# Altium schematic sheet 15_Power_DCIN.SchDoc
size 420 x 297 mm
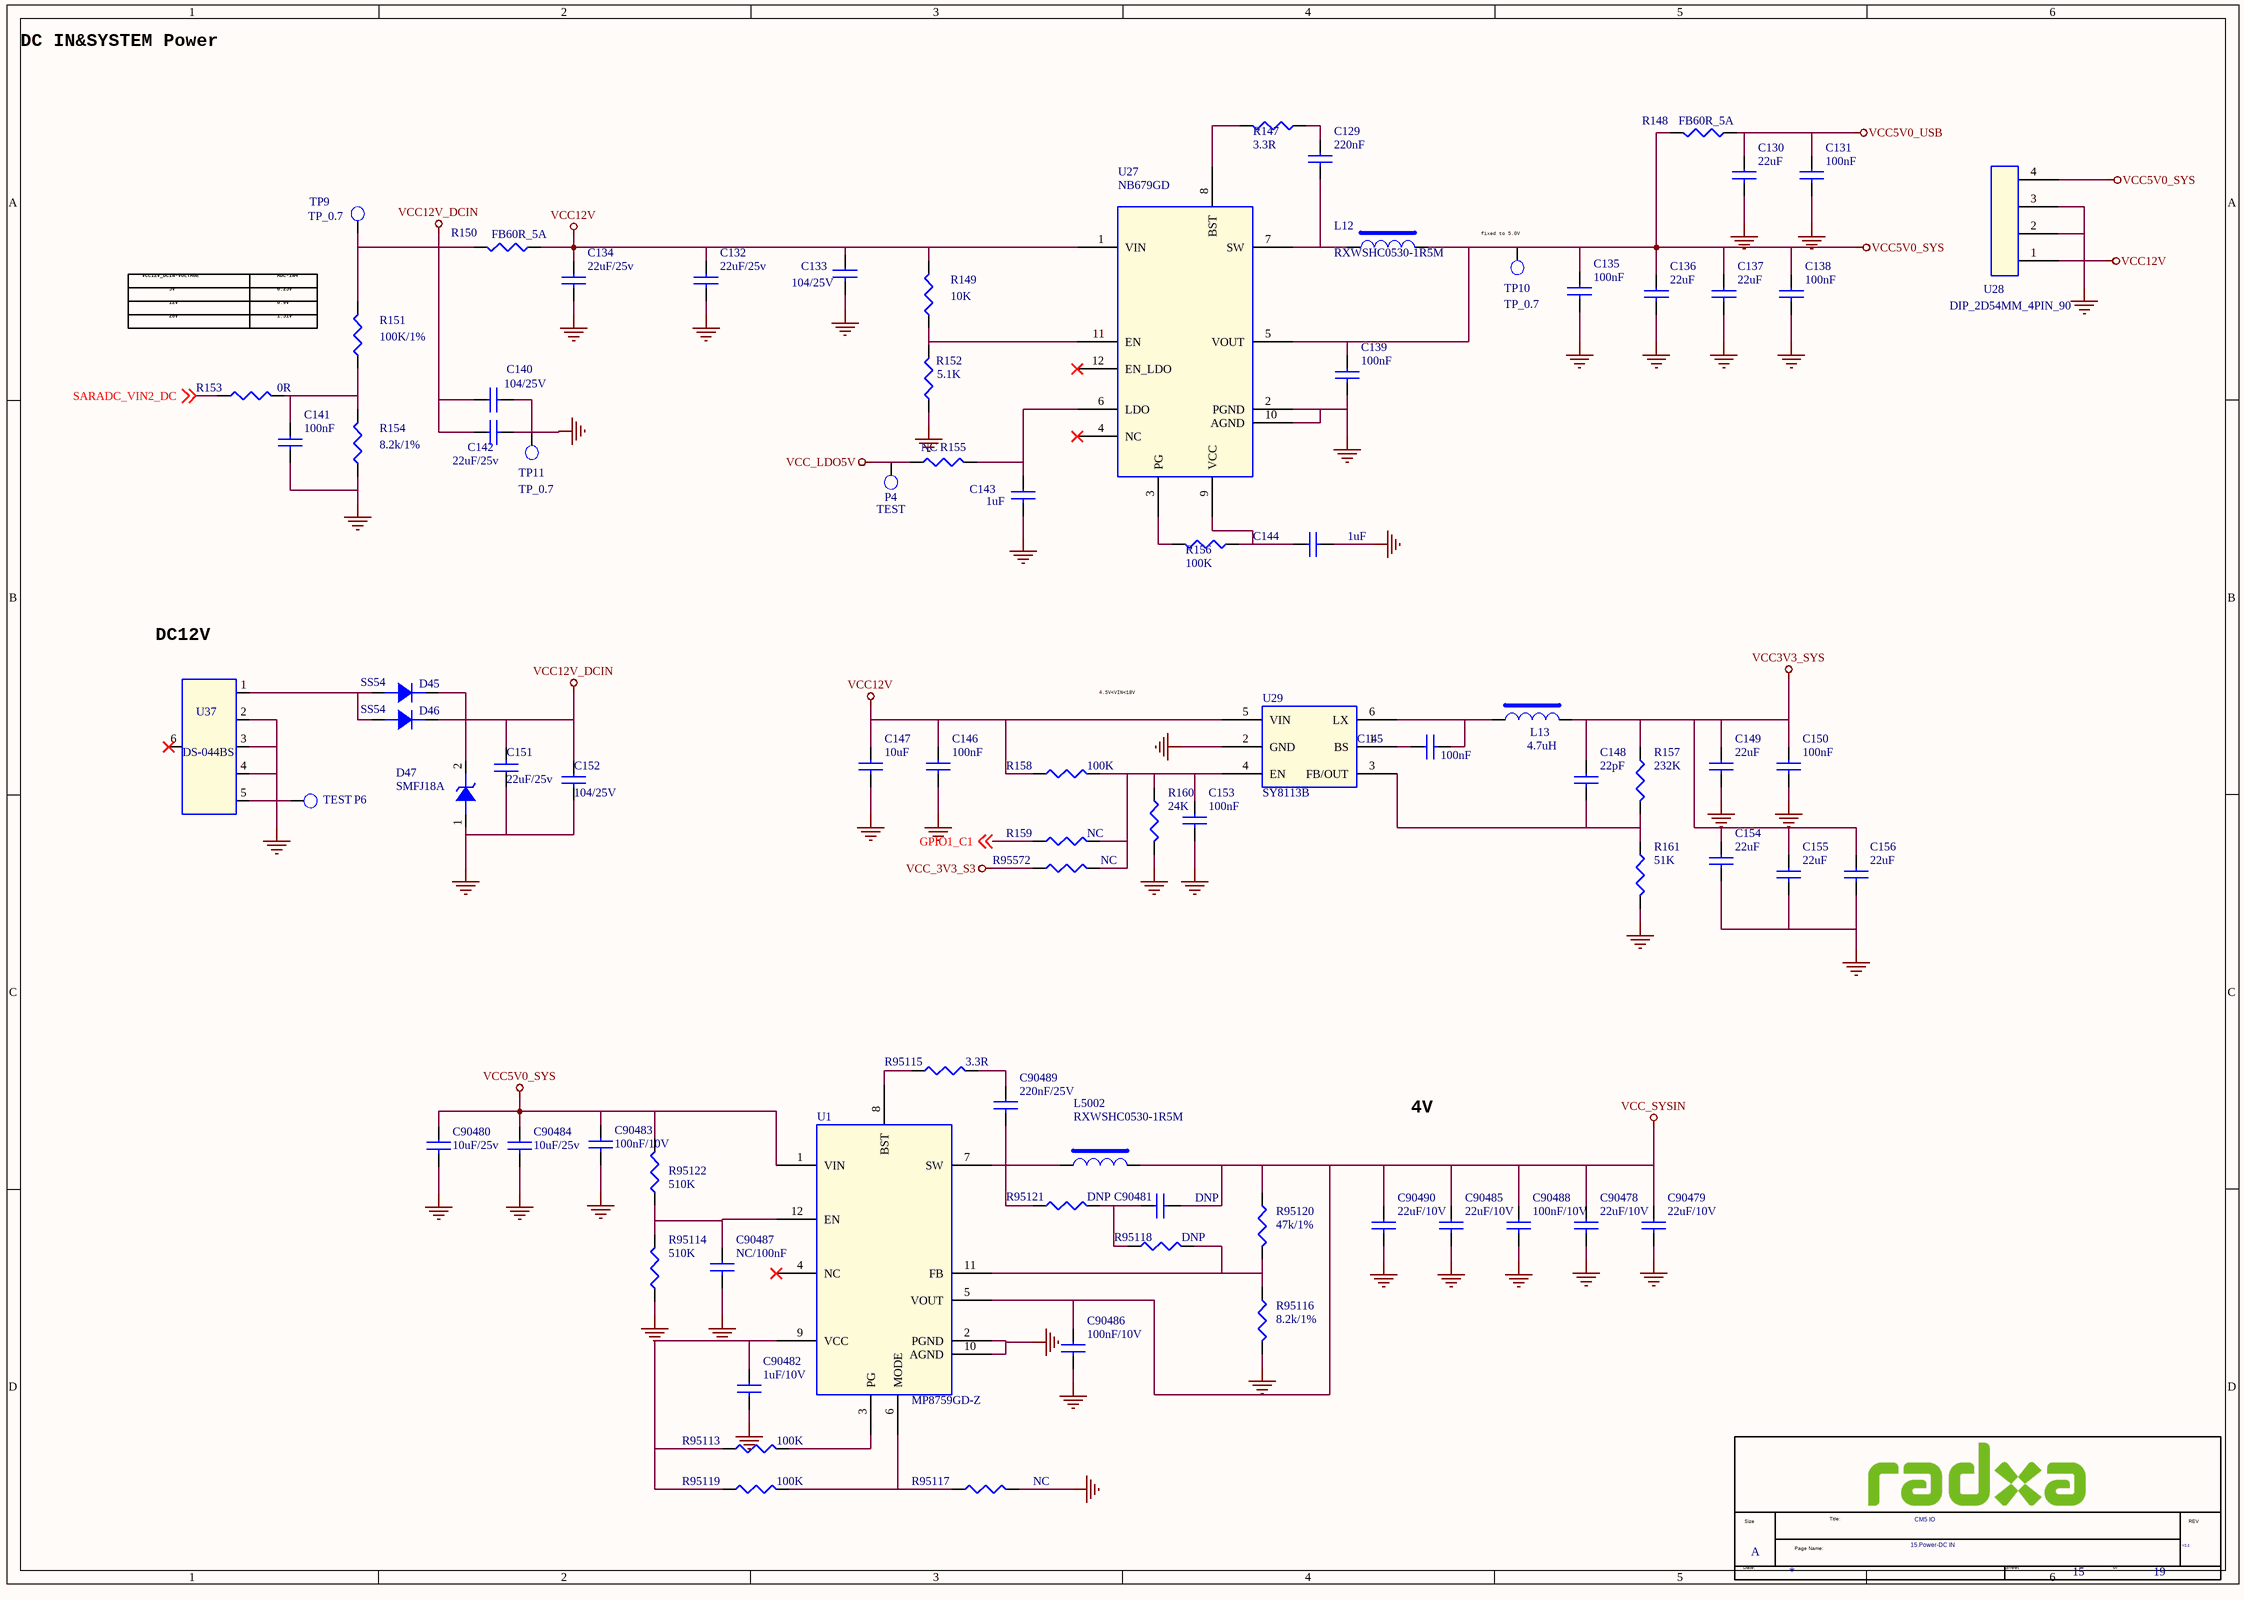
[diagram p0: 15_Power_DCIN.SchDoc]

## Parts
*  Doc: 15.Power-DC IN  RevCode: V2.2  Title: CM5 IO  Page Size: A  Page Number: 15  Page Count: 19  (hidden comment: radxa_1010)  (graphical)
C129  220nF  [C0402]
C130  22uF  [C0603]
C131  100nF  [C0402]
C132  22uF/25v  [C0805]
C133  104/25V  [C0402]
C134  22uF/25v  [C0805]
C135  100nF  [C0402]
C136  22uF  [C0603]
C137  22uF  [C0603]
C138  100nF  [C0402]
C139  100nF  [C0402]
C140  104/25V  [C0402]
C141  100nF  [C0402]
C142  22uF/25v  [C0805]
C143  1uF  [C0402]
C144  1uF  [C0402]
C145  100nF  [C0402]
C146  100nF  [C0402]
C147  10uF  [C1206]
C148  22pF  [C0402]
C149  22uF  [C0805]
C150  100nF  [C0402]
C151  22uF/25v  [C0805]
C152  104/25V  [C0402]
C153  100nF  [C0402]
C154  22uF  [C0805]
C155  22uF  [C0805]
C156  22uF  [C0805]
C90478  22uF/10V  [C0805]
C90479  22uF/10V  [C0805]
C90480  10uF/25v  [C1206]
C90481  DNP  [C0201]
C90482  1uF/10V  [C0201]
C90483  100nF/10V  [C0402]
C90484  10uF/25v  [C1206]
C90485  22uF/10V  [C0805]
C90486  100nF/10V  [C0201]
C90487  NC/100nF  [C0201]
C90488  100nF/10V  [C0402]
C90489  220nF/25V  [C0402]
C90490  22uF/10V  [C0805]
D45  SS54  [DO_214AC]
D46  SS54  [DO_214AC]
D47  SMFJ18A  [SOD_123]
L12  RXWSHC0530-1R5M  [IND-5020]
L13  4.7uH  [IND-5020]
L5002  RXWSHC0530-1R5M  [IND-5020]
P4  TEST  [TEST]
P6  TEST  [TEST]
R147  3.3R  [R0402]
R148  FB60R_5A  [R1206]
R149  10K  [R0402]
R150  FB60R_5A  [R1206]
R151  100K/1%  [R0402]
R152  5.1K  [R0402]
R153  0R  [R0402]
R154  8.2k/1%  [R0402]
R155  NC  [R0402]
R156  100K  [R0402]
R157  232K  [R0402]
R158  100K  [R0402]
R159  NC  [R0402]
R160  24K  [R0402]
R161  51K  [R0402]
R95113  100K  [R0402]
R95114  510K  [R0402]
R95115  3.3R  [R0402]
R95116  8.2k/1%  [R0402]
R95117  NC  [R0402]
R95118  DNP  [R0402]
R95119  100K  [R0402]
R95120  47k/1%  [R0402]
R95121  DNP  [R0402]
R95122  510K  [R0402]
R95572  NC  [R0402]
TP9  TP_0.7  [TEST]
TP10  TP_0.7  [TEST]
TP11  TP_0.7  [TEST]
U1  MP8759GD-Z  [QFN12_2R00X3R00X1R00]
U27  NB679GD  [QFN12_3R00X2R00X0R90]
U28  DIP_2D54MM_4PIN_90  [XIAO_4PIN_2D54]
U29  SY8113B  [SOT_23_6]
U37  DS-044BS  [DC-044A]

## Nets
GND: C130.2 C131.2 C132.2 C133.2 C134.2 C135.2 C136.2 C137.2 C138.2 C139.2 C140.2 C141.2 C142.2 C143.2 C144.2 C146.2 C147.2 C149.2 C150.2 C151.1 C152.2 C153.2 C154.2 C155.2 C156.2 C90478.2 C90479.2 C90480.2 C90482.2 C90483.2 C90484.2 C90485.2 C90486.2 C90487.2 C90488.2 C90490.2 D47.1(ANODE) P6.1 R152.1 R154.1 R160.2 R161.2 R95114.1 R95116.2 R95117.2 TP11.1 U1.2(PGND) U1.10(AGND) U27.2(PGND) U27.10(AGND) U28.2 U28.3 U29.2(GND) U37.2 U37.3 U37.4 U37.5
VCC3V3_SYS: C148.1 C149.1 C150.1 C154.1 C155.1 C156.1 L13.2 R157.1
VCC5V0_SYS: C135.1 C136.1 C137.1 C138.1 C139.1 C90480.1 C90483.1 C90484.1 L12.2 R148.2 R95122.2 TP10.1 U1.1(VIN) U27.5(VOUT) U28.4
VCC5V0_USB: C130.1 C131.1 R148.1
VCC12V: C132.1 C133.1 C134.1 C146.1 C147.1 R149.2 R150.1 R158.1 U27.1(VIN) U28.1 U29.5(VIN)
VCC12V_DCIN: C140.1 C142.1 C151.2 C152.1 D45.2(K) D46.2(K) D47.2(CATHODE) R150.2 R151.2 TP9.1
VCC_3V3_S3: R95572.1
VCC_LDO5V: P4.1 R155.1
VCC_SYSIN: C90478.1 C90479.1 C90481.2 C90485.1 C90486.1 C90488.1 C90490.1 L5002.2 R95120.1 U1.5(VOUT)
GPIO1_C1: R159.1 ; off-sheet GPIO1_C1
SARADC_VIN2_DC: R153.1 ; off-sheet SARADC_VIN2_DC
NetC129_1: C129.1 R147.2
NetC129_2: C129.2 L12.1 U27.7(SW)
NetC141_1: C141.1 R151.1 R153.2 R154.2
NetC143_1: C143.1 R155.2 U27.6(LDO)
NetC144_1: C144.1 R156.2 U27.9(VCC)
NetC145_1: C145.1 U29.1(BS)
NetC145_2: C145.2 L13.1 U29.6(LX)
NetC148_2: C148.2 R157.2 R161.1 U29.3(FB/OUT)
NetC153_1: C153.1 R158.2 R159.2 R160.1 R95572.2 U29.4(EN)
NetC90481_1: C90481.1 R95118.1 R95121.2
NetC90482_1: C90482.1 R95113.1 R95119.1 U1.9(VCC)
NetC90487_1: C90487.1 R95114.2 R95122.1 U1.12(EN)
NetC90489_1: C90489.1 R95115.2
NetC90489_2: C90489.2 L5002.1 R95121.1 U1.7(SW)
NetD45_1: D45.1(A) D46.1(A) U37.1
NetR147_1: R147.1 U27.8(BST)
NetR149_1: R149.1 R152.2 U27.11(EN)
NetR156_1: R156.1 U27.3(PG)
NetR95113_2: R95113.2 U1.3(PG)
NetR95115_1: R95115.1 U1.8(BST)
NetR95116_1: R95116.1 R95118.2 R95120.2 U1.11(FB)
NetR95117_1: R95117.1 R95119.2 U1.6(MODE)

Not connected (* = marked no-connect by the designer): U1 4(NC)*; U27 4(NC)* 12(EN_LDO)*; U37 6*

## Notes on the sheet
- DC IN&SYSTEM Power
- (near TP10) fixed to 5.0V
- VCC12V_DCIN-VOLTAGE
- 5V
- 12V
- 20V
- 0.25V
- 1.51V
- ADC-IN4
- 0.9V
- (near U37) DC12V
- 4.5V<VIN<18V
- 4V
- (in symbol radxa_1010) Size; Title:; REV; Page Name:; Date:; Sheet; of

## Library data of the parts
C129 = CAP NP_0: cap,220.00nF,+/-10%,25V,X5R,C0402; Manufacturer PN: C1005X5R1E224K050BC; Manufacturer: TDK; Tolerance: 10%; Priority: A; Voltage: 25V; PCB Footprint: C0402; Dielectric: X5R; Created by: JJJ; Part Type: C0402; RK PN: C1005X5R1E224K050BC
C130 C136 C137 = CAP NP_0: cap,22.00uF,+/-10%,10V,X5R,C0805; Manufacturer: TDK; RK PN: C2012X5R1A226K125AB; Priority: A; Tolerance: 10%; Voltage: 10V; PCB Footprint: C0603; Dielectric: X5R; Part Type: C0805; Manufacturer PN: C2012X5R1A226K125AB; Created by: JJJ
C131 C135 C138 C139 = CAP NP_0: cap,100.00nF,+/-10%,16V,X5R,C0402; Manufacturer PN: C1005X5R1C104K050BA; Manufacturer: TDK; Tolerance: 10%; Priority: A; Voltage: 16V; PCB Footprint: C0402; Dielectric: X5R; Created by: JJJ; Part Type: C0402; RK PN: C1005X5R1C104K050BA
C132 C142 = CAP NP_0: cap,10.00uF,+/-10%,16V,X5R,C0805; Manufacturer: TDK; RK PN: C2012X5R1C106K125AC; Priority: A; Tolerance: 10%; Voltage: 16V; PCB Footprint: C0805; Dielectric: X5R; Part Type: C0805; Manufacturer PN: C2012X5R1C106K125AC; Created by: JJJ
C133 C140 = CAP NP_0: cap,1.00uF,+/-10%,16V,X5R,C0402; Manufacturer PN: C1005X5R1C105K050BC; Manufacturer: TDK; Voltage: 25V; Tolerance: 10%; Priority: A; PCB Footprint: C0402; Dielectric: X5R; Created by: JJJ; Part Type: C0402; RK PN: C1005X5R1C105K050BC
C134 = CAP NP_0: cap,10.00uF,+/-10%,16V,X5R,C0805; Manufacturer PN: C2012X5R1C106K125AC; Manufacturer: TDK; Tolerance: 10%; Priority: A; Voltage: 16V; PCB Footprint: C0805; Dielectric: X5R; Created by: JJJ; Part Type: C0805; RK PN: C2012X5R1C106K125AC
C141 = CAP NP_0: cap,100.00nF,+/-10%,16V,X5R,C0402; Manufacturer: TDK; RK PN: C1005X5R1C104K050BA; Priority: A; Tolerance: 10%; Voltage: 16V; PCB Footprint: C0402; Dielectric: X5R; Part Type: C0402; Manufacturer PN: C1005X5R1C104K050BA; Created by: JJJ
C143 = CAP NP_0: cap,1.00uF,+/-10%,16V,X5R,C0402; Manufacturer: TDK; RK PN: C1005X5R1C105K050BC; Priority: A; Tolerance: 10%; Voltage: 16V; PCB Footprint: C0402; Dielectric: X5R; Part Type: C0402; Manufacturer PN: C1005X5R1C105K050BC; Created by: JJJ
C144 = CAP NP_0: cap,1.00uF,+/-10%,16V,X5R,C0402; Manufacturer PN: C1005X5R1C105K050BC; Manufacturer: TDK; Tolerance: 10%; Priority: A; Voltage: 16V; PCB Footprint: C0402; Dielectric: X5R; Created by: JJJ; Part Type: C0402; RK PN: C1005X5R1C105K050BC
C145 = CAP NP_0: cap,100.00nF,+/-10%,25V,X5R,C0402; Manufacturer: TDK; Number: 37; RK PN: C1005X5R1E104K050BC; Priority: A; Tolerance: 10%; C_Voltage: 6.3V; Voltage: 25V; PCB Footprint: C0402; Dielectric: X5R; Part Type: C0402; Manufacturer PN: C1005X5R1E104K050BC; Created by: JJJ
C146 = CAP NP_0: cap,100.00nF,+/-10%,25V,X5R,C0402; Manufacturer: TDK; RK PN: C1005X5R1E104K050BC; Priority: A; Tolerance: 10%; Voltage: 25V; PCB Footprint: C0402; Dielectric: X5R; Part Type: C0402; Manufacturer PN: C1005X5R1E104K050BC; Created by: JJJ
C147 = CAP NP_0: cap,10.00uF,+/-10%,25V,X5R,C1206; Manufacturer: TDK; RK PN: C3216X5R1E106K085AC; Priority: A; C_Voltage: 6.3V; Tolerance: 10%; Voltage: 25V; PCB Footprint: C1206; Dielectric: X5R; Part Type: C1206; Manufacturer PN: C3216X5R1E106K085AC; Created by: JJJ
C148 = CAP NP_0: cap,22.00pF,+/-5%,50V,C0G,C0402; Manufacturer: TDK; Manufacturer PN: C1005C0G1H220J050BA; Tolerance: 5%; Priority: A; Voltage: 50V; PCB Footprint: C0402; Dielectric: C0G; Created by: JJJ; Part Type: C0402; RK PN: C1005C0G1H220J050BA
C149 C155 = CAP NP_0: cap,22.00uF,+/-10%,10V,X5R,C0805; Manufacturer: TDK; RK PN: C2012X5R1A226K125AB; Priority: A; C_Voltage: 6.3V; Tolerance: 10%; Voltage: 10V; PCB Footprint: C0805; Dielectric: X5R; Part Type: C0805; Manufacturer PN: C2012X5R1A226K125AB; Created by: JJJ
C150 = CAP NP_0: cap,100.00nF,+/-10%,10V,X5R,C0402; Manufacturer: TDK; Number: 37; RK PN: C1005X5R1A104K050BA; Priority: A; Tolerance: 10%; C_Voltage: 6.3V; Voltage: 10V; PCB Footprint: C0402; Dielectric: X5R; Part Type: C0402; Manufacturer PN: C1005X5R1A104K050BA; Created by: JJJ
C151 = CAP NP_4: PCB Footprint: C0805
C152 = CAP NP: CAP,MLCC,1nF,+/-10%,X5R,6.3V,SMD0402; MARK: 22P; ROOM: USB+5V; PCB Footprint: C0402
C153 = CAP NP_0: cap,100.00nF,+/-10%,10V,X5R,C0402; Manufacturer PN: C1005X5R1A104K050BA; Manufacturer: TDK; C_Voltage: 6.3V; Tolerance: 10%; Priority: A; Number: 37; Voltage: 10V; PCB Footprint: C0402; Dielectric: X5R; Created by: JJJ; Part Type: C0402; RK PN: C1005X5R1A104K050BA
C154 C156 = CAP NP_0: cap,22.00uF,+/-10%,10V,X5R,C0805; Manufacturer PN: C2012X5R1A226K125AB; Manufacturer: TDK; Tolerance: 10%; C_Voltage: 6.3V; Priority: A; Voltage: 10V; PCB Footprint: C0805; Dielectric: X5R; Created by: JJJ; Part Type: C0805; RK PN: C2012X5R1A226K125AB
C90478 C90479 C90490 = CAP NP_0_Dup2: cap,22.00uF,+/-10%,10V,X5R,C0805; Manufacturer: TDK; RK PN: C2012X5R1A226K125AB; Priority: A; C_Voltage: 6.3V; Tolerance: 10%; Voltage: 10V; PCB Footprint: C0805; Dielectric: X5R; Part Type: C0805; Manufacturer PN: C2012X5R1A226K125AB; Created by: JJJ
C90480 = CAP NP_0_Dup2: cap,10.00uF,+/-10%,25V,X5R,C1206; Manufacturer: TDK; RK PN: C3216X5R1E106K085AC; Priority: A; C_Voltage: 6.3V; Tolerance: 10%; Voltage: 25V; PCB Footprint: C1206; Dielectric: X5R; Part Type: C1206; Manufacturer PN: C3216X5R1E106K085AC; Created by: JJJ
C90481 = CAP NP_0_Dup2: Did Not Place.; Number: 37; RK PN: DNPC0402; Priority: A; C_Voltage: 6.3V; PCB Footprint: C0201; Part Type: DNP; Manufacturer PN: DNPC0402; Created by: JJJ
C90482 = CAP NP_0_Dup2: cap,1.00uF,+/-10%,10V,X5R,C0402; Manufacturer PN: C1005X5R1A105K050BB; Manufacturer: TDK; C_Voltage: 6.3V; Tolerance: 10%; Priority: A; Number: 37; Voltage: 10V; PCB Footprint: C0201; Dielectric: X5R; Created by: JJJ; Part Type: C0402; RK PN: C1005X5R1A105K050BB
C90483 = CAP NP_0_Dup2: cap,100.00nF,+/-10%,50V,X5R,C0603; Manufacturer PN: C1608X5R1H104K080AA; Manufacturer: TDK; Tolerance: 10%; Priority: A; Voltage: 50V; PCB Footprint: C0402; Dielectric: X5R; Created by: JJJ; Part Type: C0603; RK PN: C1608X5R1H104K080AA
C90484 = CAP NP_0_Dup2: cap,10.00uF,+/-10%,25V,X5R,C1206; Manufacturer PN: C3216X5R1E106K085AC; Manufacturer: TDK; Tolerance: 10%; C_Voltage: 6.3V; Priority: A; Voltage: 25V; PCB Footprint: C1206; Dielectric: X5R; Created by: JJJ; Part Type: C1206; RK PN: C3216X5R1E106K085AC
C90485 = CAP NP_0_Dup2: cap,22.00uF,+/-10%,10V,X5R,C0805; Manufacturer PN: C2012X5R1A226K125AB; Manufacturer: TDK; Tolerance: 10%; C_Voltage: 6.3V; Priority: A; Voltage: 10V; PCB Footprint: C0805; Dielectric: X5R; Created by: JJJ; Part Type: C0805; RK PN: C2012X5R1A226K125AB
C90486 = CAP NP_0_Dup2: cap,100.00nF,+/-10%,10V,X5R,C0402; Manufacturer: TDK; Number: 37; RK PN: C1005X5R1A104K050BA; Priority: A; Tolerance: 10%; C_Voltage: 6.3V; Voltage: 10V; PCB Footprint: C0201; Dielectric: X5R; Part Type: C0402; Manufacturer PN: C1005X5R1A104K050BA; Created by: JJJ
C90487 = CAP NP_0_Dup2: cap,100.00nF,+/-10%,25V,X5R,C0402; Manufacturer: TDK; Option: DNP; Number: 37; RK PN: C1005X5R1E104K050BC; Priority: A; Tolerance: 10%; C_Voltage: 6.3V; Voltage: 25V; PCB Footprint: C0201; Dielectric: X5R; Part Type: C0402; Manufacturer PN: C1005X5R1E104K050BC; Created by: JJJ
C90488 = CAP NP_0_Dup2: cap,100.00nF,+/-10%,10V,X5R,C0402; Manufacturer PN: C1005X5R1A104K050BA; Manufacturer: TDK; C_Voltage: 6.3V; Tolerance: 10%; Priority: A; Number: 37; Voltage: 10V; PCB Footprint: C0402; Dielectric: X5R; Created by: JJJ; Part Type: C0402; RK PN: C1005X5R1A104K050BA
C90489 = CAP NP_0_Dup2: cap,220.00nF,+/-10%,25V,X5R,C0402; Manufacturer: TDK; Number: 37; RK PN: C1005X5R1E224K050BC; Priority: A; Tolerance: 10%; C_Voltage: 6.3V; Voltage: 25V; PCB Footprint: C0402; Dielectric: X5R; Part Type: C0402; Manufacturer PN: C1005X5R1E224K050BC; Created by: JJJ
D45 = DIODE: Schottky Barrier，SS32 DO214AC; Manufacturer: 星海; ROOM: CHG; RK PN: SS32; Priority: A; PCB Footprint: DO_214AC; Part Type: Schottky rectifier; Manufacturer PN: SS32; Created by: JJJ
D46 = DIODE: Schottky Barrier，SS32 DO214AC; Manufacturer PN: SS32; Manufacturer: 星海; Priority: A; ROOM: CHG; PCB Footprint: DO_214AC; Created by: JJJ; Part Type: Schottky rectifier; RK PN: SS32
D47 = DIODE ZENER1: 1-Line, Uni-directional, Transient Voltage Suppressor; Manufacturer: WillSemi(韦尔半导体); RK PN: ESD5621W-2/TR; Priority: A; PCB Footprint: SOD_123; Part Type: ESD_TVS; Manufacturer PN: ESD5621W-2/TR; Created by: JJJ
L12 = INDUCTORS OF FERRITE: PCB Footprint: IND-5020
L13 = INDUCTORS OF FERRITE_Dup1: Power Inductor,4.7uH,0.2,IND_606045; Manufacturer PN: SWPA6045S4R7MT; Manufacturer: sunlord; DC Resistor: 0.02ohm; Isat: 4.97A; Resonace frequency: 24M; Irms: 3.3A; Tolerance: 20%; Priority: A; PCB Footprint: IND-5020; Created by: YWQ; Part Type: POWER_IND; RK PN: SWPA6045S4R7MT
L5002 = INDUCTORS OF FERRITE_Dup1: Power Inductor,1.5uH,MWSA0603S-1R5MT; Manufacturer: Vishay; Isat: 9.6A; Option: >8A; Irms: 10.5A; Tolerance: 20%; Priority: A; PCB Footprint: IND-5020; Created by: JJJ; Part Type: IND
P4 P6 = TESTPOINT1: PCB Footprint: TP_0R70
R147 = RESISTOR_0_Dup3: 通用厚膜电阻,3R3,+/-5%,R0402,1/16W.; Manufacturer: YAGEO; Tolerance: 5%; RK PN: RC0402JR-073R3L; Priority: A; Wattage: 1/16W; PCB Footprint: R0402; Part Type: 通用厚膜电阻; Manufacturer PN: RC0402JR-073R3L; Created by: YTL
R148 R150 = R_0: PCB Footprint: R1206
R149 R152 = RESISTOR_0_Dup3: 通用厚膜电阻,10K,+/-5%,R0402,1/16W.; Manufacturer PN: RC0402JR-0710KL; Manufacturer: YAGEO; Tolerance: 5%; Wattage: 1/16W; Priority: A; PCB Footprint: R0402; Created by: YTL; Part Type: 通用厚膜电阻; RK PN: RC0402JR-0710KL
R151 R154 = RESISTOR_2: 通用厚膜电阻,10K,+/-5%,R0402,1/16W.; Manufacturer PN: RC0402JR-0710KL; Manufacturer: YAGEO; Tolerance: 5%; Wattage: 1/16W; Priority: A; PCB Footprint: R0402; Created by: YTL; Part Type: 通用厚膜电阻; RK PN: RC0402JR-0710KL
R153 R155 = RESISTOR_2: 通用厚膜电阻,10K,+/-5%,R0402,1/16W.; Manufacturer: YAGEO; Tolerance: 5%; RK PN: RC0402JR-0710KL; Priority: A; Wattage: 1/16W; PCB Footprint: R0402; Part Type: 通用厚膜电阻; Manufacturer PN: RC0402JR-0710KL; Created by: YTL
R156 R159 = RESISTOR_0_Dup3: 通用厚膜电阻,100K,+/-5%,R0402,1/16W.; Manufacturer: YAGEO; Tolerance: 5%; RK PN: RC0402JR-07100KL; Priority: A; Wattage: 1/16W; PCB Footprint: R0402; Part Type: 通用厚膜电阻; Manufacturer PN: RC0402JR-07100KL; Created by: YTL
R157 = RESISTOR_0_Dup3: 通用厚膜电阻,232K,+/-1%,R0402,1/16W.; Manufacturer: YAGEO; Tolerance: 1%; RK PN: RC0402FR-07232KL; Priority: A; Wattage: 1/16W; PCB Footprint: R0402; Part Type: 通用厚膜电阻; Manufacturer PN: RC0402FR-07232KL; Created by: YTL
R158 R95572 = RESISTOR_0_Dup3: 通用厚膜电阻,100K,+/-5%,R0402,1/16W.; Manufacturer PN: RC0402JR-07100KL; Manufacturer: YAGEO; Tolerance: 5%; Wattage: 1/16W; Priority: A; PCB Footprint: R0402; Created by: YTL; Part Type: 通用厚膜电阻; RK PN: RC0402JR-07100KL
R160 = RESISTOR_0_Dup3: 通用厚膜电阻,24K,+/-5%,R0402,1/16W.; Manufacturer: YAGEO; Tolerance: 5%; RK PN: RC0402JR-0724KL; Priority: A; Wattage: 1/16W; PCB Footprint: R0402; Part Type: 通用厚膜电阻; Manufacturer PN: RC0402JR-0724KL; Created by: YTL
R161 = RESISTOR_0_Dup3: 通用厚膜电阻,49K9,+/-1%,R0402,1/16W.; Manufacturer PN: RC0402FR-0749K9L; Manufacturer: YAGEO; Tolerance: 1%; Wattage: 1/16W; Priority: A; PCB Footprint: R0402; Created by: YTL; Part Type: 通用厚膜电阻; RK PN: RC0402FR-0749K9L
R95113 R95119 = RESISTOR_1_Dup1: 通用厚膜电阻,100K,+/-5%,R0402,1/16W.; Manufacturer: YAGEO; PCB Footprint: R0201; Tolerance: 5%; RK PN: RC0402JR-07100KL; Priority: A; Wattage: 1/16W; Part Type: 通用厚膜电阻; Manufacturer PN: RC0402JR-07100KL; Created by: YTL
R95114 = RESISTOR_1_Dup1: 通用厚膜电阻,100K,+/-5%,R0402,1/16W.; Manufacturer PN: RC0402JR-07100KL; Manufacturer: YAGEO; PCB Footprint: R0201; Tolerance: 5%; Wattage: 1/16W; Priority: A; Created by: YTL; Part Type: 通用厚膜电阻; RK PN: RC0402JR-07100KL
R95115 = RESISTOR_1_Dup1: 通用厚膜电阻,3R3,+/-5%,R0402,1/16W.; Manufacturer: YAGEO; Tolerance: 5%; RK PN: RC0402JR-073R3L; Priority: A; Wattage: 1/16W; PCB Footprint: R0402; Part Type: 通用厚膜电阻; Manufacturer PN: RC0402JR-073R3L; Created by: YTL
R95116 = RESISTOR_1_Dup1: 通用厚膜电阻,7K5,+/-1%,R0402,1/16W.; Manufacturer: YAGEO; PCB Footprint: R0201; Tolerance: 1%; RK PN: RC0402FR-077K5L; Priority: A; Wattage: 1/16W; Part Type: 通用厚膜电阻; Manufacturer PN: RC0402FR-077K5L; Created by: YTL
R95117 = RESISTOR_1_Dup1: 通用厚膜电阻,100K,+/-5%,R0402,1/16W.; Manufacturer PN: RC0402JR-07100KL; Manufacturer: YAGEO; PCB Footprint: R0201; Tolerance: 5%; Wattage: 1/16W; Priority: A; Option: DNP; Created by: YTL; Part Type: 通用厚膜电阻; RK PN: RC0402JR-07100KL
R95118 = RESISTOR_1_Dup1: Did Not Place.; Manufacturer PN: DNPR0402; PCB Footprint: R0201; Priority: A; Created by: JJJ; Part Type: DNP; RK PN: DNPR0402
R95120 = RESISTOR_1_Dup1: 通用厚膜电阻,43K,+/-1%,R0402,1/16W.; Manufacturer PN: RC0402FR-0743KL; Manufacturer: YAGEO; PCB Footprint: R0201; Tolerance: 1%; Wattage: 1/16W; Priority: A; Created by: YTL; Part Type: 通用厚膜电阻; RK PN: RC0402FR-0743KL
R95121 = RESISTOR_1_Dup1: Did Not Place.; PCB Footprint: R0201; RK PN: DNPR0402; Priority: A; Part Type: DNP; Manufacturer PN: DNPR0402; Created by: JJJ
R95122 = RESISTOR_1_Dup1: 通用厚膜电阻,510K,+/-5%,R0402,1/16W.; Manufacturer: YAGEO; PCB Footprint: R0201; Tolerance: 5%; RK PN: RC0402JR-07510KL; Priority: A; Wattage: 1/16W; Part Type: 通用厚膜电阻; Manufacturer PN: RC0402JR-07510KL; Created by: YTL
TP9 TP10 = TP: Test Point 0.7mm; PCB Footprint: TP_0R70; RK PN: TESTPOINT_0R7; Priority: A; Part Type: TP; Created by: JJJ
TP11 = TP: Test Point 0.7mm; PCB Footprint: TP_0R70; Priority: A; RK PN: TESTPOINT_0R7; Created by: JJJ; Part Type: TP
U1 = MP8759_6: PCB Footprint: QFN12_2R00X3R00X1R00
U27 = DCDC_NB679: 26 V, Low Iq, High Current, Fixed 5 V-8 A Synchronous Buck Converter with 100 mA LDO;; Manufacturer: MPS （美国芯源）; PCB Footprint: QFN12_2R00X3R00X1R00; RK PN: NB679GD; Priority: A; Part Type: DCDC; Manufacturer PN: NB679GD; Created by: JJJ
U28 = CON3_2: PCB Footprint: XIAO_4PIN_2D54
U29 = DCDC_SY8113: Manufacturer: Silergy（矽力杰）; Priority: A; PCB Footprint: SOT_23_6; RK PN: SY8113B; Part Type: DCDC; Manufacturer PN: SY8113B; Created by: JJJ
U37 = CON3_0: PCB Footprint: DC-044A
* = radxa_1010: Page Create Date: March  8, 1995; Page Modify Date: *